# Altium schematic sheet StEth32_µC.SchDoc
size A4
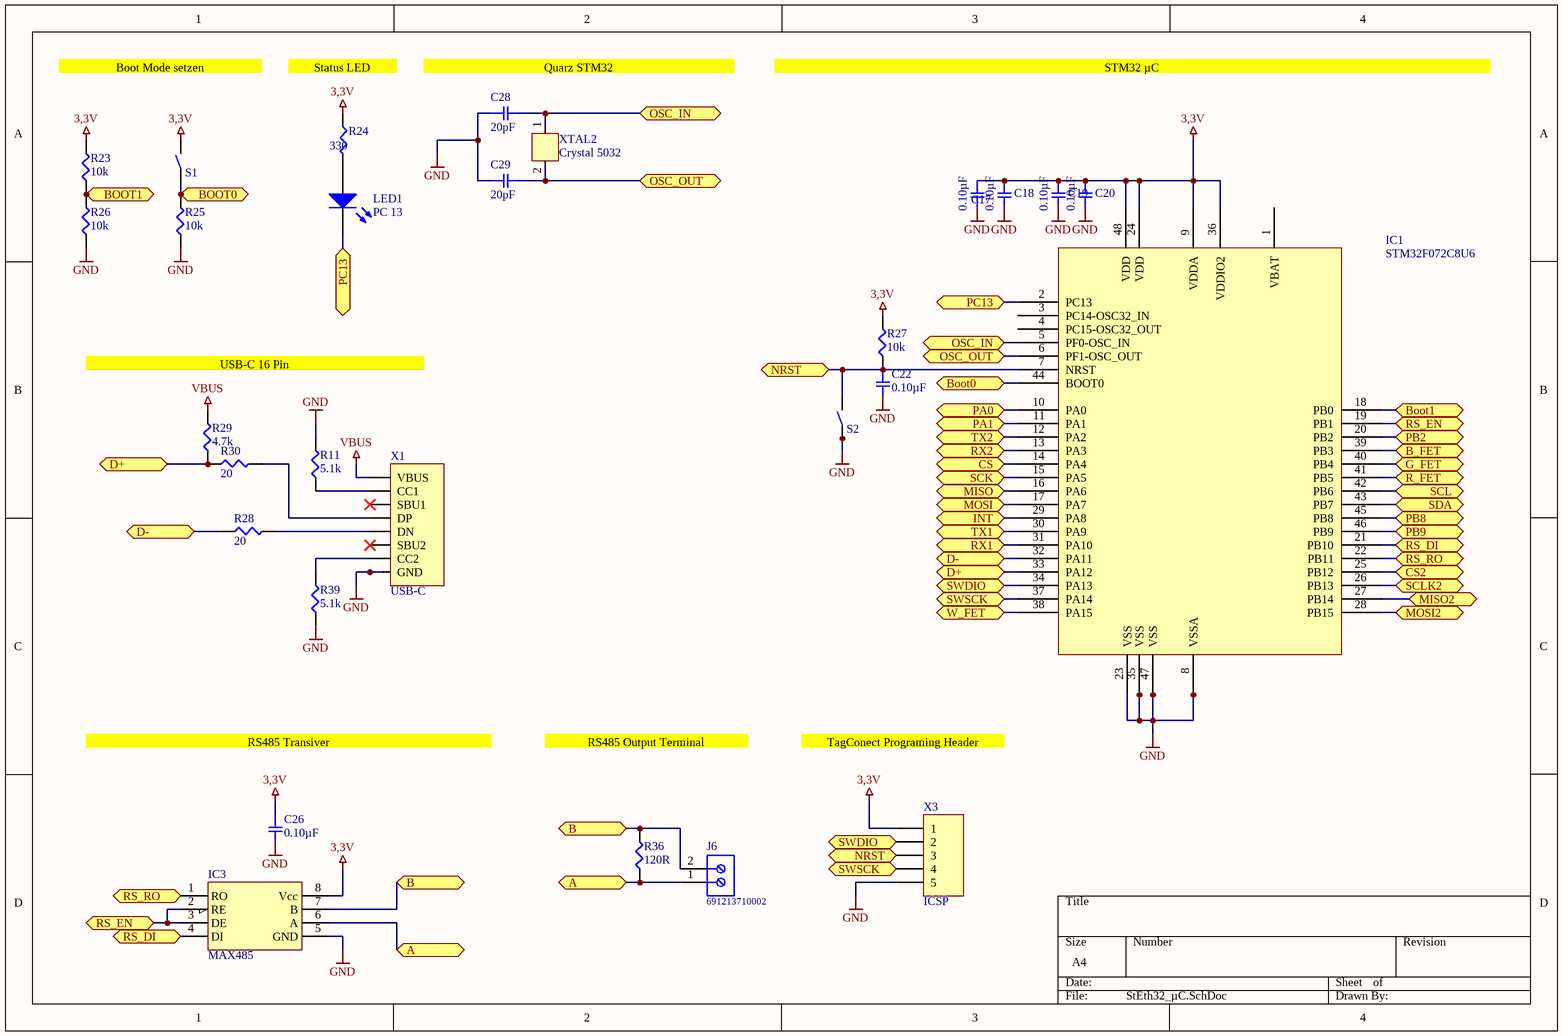
[diagram p0: StEth32_µC.SchDoc]

## Parts
C17  0.10µF  [SMD-0603C]
C18  0.10µF  [SMD-0603C]
C19  0.10µF  [SMD-0603C]
C20  0.10µF  [SMD-0603C]
C22  0.10µF  [SMD-0603C]
C26  0.10µF  [SMD-0603C]
C28  20pF  [SMD-0603C]
C29  20pF  [SMD-0603C]
IC1  STM32F072C8U6  [LQFP-48]
IC3  MAX485  [D008_L]
J6  691213710002  [691213710002]
LED1  PC 13  [0603_A]
R11  5.1k  [SMD-0603-RES]
R23  10k  [SMD-0603-RES]
R24  330  [SMD-0603-RES]
R25  10k  [SMD-0603-RES]
R26  10k  [SMD-0603-RES]
R27  10k  [SMD-0603-RES]
R28  20  [SMD-0603-RES]
R29  4.7k  [SMD-0603-RES]
R30  20  [SMD-0603-RES]
R36  120R  [SMD-0603-RES]
R39  5.1k  [SMD-0603-RES]
S1  Boot  [Button5050]  (value not drawn)
S2  Reset  [Button5050]  (value not drawn)
X1  USB-C  [USB-C]
X3  ICSP  [TC2030-MCP-NL]
XTAL2  Crystal 5032  [5032]

## Ports
A (bidir), B (bidir), B_FET (bidir), Boot0 (bidir), BOOT0 (bidir), BOOT1 (bidir), Boot1 (bidir), CS2 (bidir), CS (bidir), D+ (bidir), D- (bidir), G_FET (bidir), INT (bidir), MISO2 (bidir), MISO (bidir), MOSI2 (bidir), MOSI (bidir), NRST (bidir), OSC_IN (bidir), OSC_OUT (bidir), PA0 (bidir), PA1 (bidir), PB2 (bidir), PB8 (bidir), PB9 (bidir), PC13 (bidir), R_FET (bidir), RS_DI (bidir), RS_EN (bidir), RS_RO (bidir), RX1 (bidir), RX2 (bidir), SCK (bidir), SCL (bidir), SCLK2 (bidir), SDA (bidir), SWDIO (bidir), SWSCK (bidir), TX1 (bidir), TX2 (bidir), W_FET (bidir)

## Nets
3,3V: C17.1 C18.1 C19.1 C20.1 C26.1 IC1.9(VDDA) IC1.24(VDD) IC1.36(VDDIO2) IC1.48(VDD) IC3.8(Vcc) R23.2 R24.1 R27.2 S1.2 X3.1
GND: C17.2 C18.2 C19.2 C20.2 C22.2 C26.2 C28.1 C29.1 IC1.8(VSSA) IC1.23(VSS) IC1.35(VSS) IC1.47(VSS) IC3.5(GND) R11.2 R25.1 R26.1 R39.1 S2.1 X1.GND X3.5
VBUS: R29.2 X1.VBUS
A: IC3.6(A) J6.1 R36.1 ; port A
B: IC3.7(B) J6.2 R36.2 ; port B
B_FET: IC1.39(PB3) ; port B_FET
Boot0: IC1.44(BOOT0) R25.2 S1.1 ; port Boot0, port BOOT0
BOOT1: IC1.18(PB0) R23.1 R26.2 ; port BOOT1, port Boot1
CS: IC1.14(PA4) ; port CS
CS2: IC1.25(PB12) ; port CS2
D+: IC1.33(PA12) R29.1 R30.1 ; port D+
D-: IC1.32(PA11) R28.1 ; port D-
G_FET: IC1.40(PB4) ; port G_FET
INT: IC1.29(PA8) ; port INT
MISO: IC1.16(PA6) ; port MISO
MISO2: IC1.27(PB14) ; port MISO2
MOSI: IC1.17(PA7) ; port MOSI
MOSI2: IC1.28(PB15) ; port MOSI2
NRST: C22.1 IC1.7(NRST) R27.1 S2.2 X3.3 ; port NRST
OSC_IN: C28.2 IC1.5(PF0-OSC_IN) XTAL2.1 ; port OSC_IN
OSC_OUT: C29.2 IC1.6(PF1-OSC_OUT) XTAL2.2 ; port OSC_OUT
PA0: IC1.10(PA0) ; port PA0
PA1: IC1.11(PA1) ; port PA1
PB2: IC1.20(PB2) ; port PB2
PB8: IC1.45(PB8) ; port PB8
PB9: IC1.46(PB9) ; port PB9
PC13: IC1.2(PC13) LED1.1(K) ; port PC13
R_FET: IC1.41(PB5) ; port R_FET
RS_DI: IC1.21(PB10) IC3.4(DI) ; port RS_DI
RS_EN: IC1.19(PB1) IC3.2(RE) IC3.3(DE) ; port RS_EN
RS_RO: IC1.22(PB11) IC3.1(RO) ; port RS_RO
RX1: IC1.31(PA10) ; port RX1
RX2: IC1.13(PA3) ; port RX2
SCK: IC1.15(PA5) ; port SCK
SCL: IC1.42(PB6) ; port SCL
SCLK2: IC1.26(PB13) ; port SCLK2
SDA: IC1.43(PB7) ; port SDA
SWDIO: IC1.34(PA13) X3.2 ; port SWDIO
SWSCK: IC1.37(PA14) X3.4 ; port SWSCK
TX1: IC1.30(PA9) ; port TX1
TX2: IC1.12(PA2) ; port TX2
W_FET: IC1.38(PA15) ; port W_FET
NetLED1_2: LED1.2(A) R24.2
NetR11_1: R11.1 X1.CC1
NetR28_2: R28.2 X1.DN
NetR30_2: R30.2 X1.DP
NetR39_2: R39.2 X1.CC2

Not connected (* = marked no-connect by the designer): IC1 1(VBAT) 3(PC14-OSC32_IN) 4(PC15-OSC32_OUT); X1 SBU1*

## Notes on the sheet
- Boot Mode setzen
- Status LED
- Quarz STM32
- STM32 µC
  STM32 µC
- USB-C 16 Pin
- RS485 Transiver
- RS485 Output Terminal
- TagConect Programing Header

## Library data of the parts
C17-C20 C22 C26 C28 C29 = GCM188R71C104KA37J: CAP CER 0.1UF 16V X7R 0603; Manufacturer: Murata Electronics North America; Factory Stock: 0; Unit Price (USD): 0.18; Minimum Quantity: 1; Tolerance: ±10%; Datasheets: http://www.murata.com/~/media/webrenewal/support/library/catalog/products/capacitor/mlcc/c03e.ashx; Image: //media.digikey.com/Renders/Murata%20Renders/0603%28GCM188%29.jpg; Digi-Key Part Number: 490-8015-1-ND; Part Number: GCM188R71C104KA37J; Quantity Available: 17844; @ qty: 0; Packaging: Cut Tape (CT); Series: GCM; Part Status: Active; Voltage: 16V; Temperature Coefficient: X7R; Operating Temperature: -55°C ~ 125°C; Features: -; Ratings: AEC-Q200; Applications: Automotive; Mounting Type: Surface Mount, MLCC; Package / Case: 0603 (1608 Metric); Size / Dimension: 0.063" L x 0.031" W (1.60mm x 0.80mm); Height - Seated (Max): -; Thickness (Max): 0.035" (0.90mm); Lead Spacing: -; Lead Style: -
  C17-C20 C22 C26: Value: 0.10µF
  C28 C29: Value: 20pF
J6 = 691213710002: Serie 213 - 5.00 mm Horizontal Entry Modular with RisingCage Clamp WR-TBL, 2 pin; Pin Number: 2; Pitch: 5.00 mm; ComponentLink1Description: Manufacturer; ComponentLink1URL: http://www.we-online.de; ComponentLink2Description: Datasheet; ComponentLink2URL: http://katalog.we-online.de/em/datasheet/6912137100xx.pdf; Part Number: 691213710002; Published Date: June 2018; Publisher: Wurth Elektronik; Operating Temperature: -40 to 105 degC; Mounting Technology: THT; Packaging: Box
LED1 = 150060SS75000: SMD mono-color Chip LED, WL-SMCW, Super Red; PackageReference: 0603_A; Color: Super Red; PartNumber: 150060SS75000; ComponentLink1Description: Manufacturer URL; ComponentLink1URL: http://www.we-online.com; ComponentLink2Description: Datasheet; ComponentLink2URL: http://katalog.we-online.com/led/datasheet/150060SS75000.pdf
R11 R39 = ERJ-3GEYJ512V: RES SMD 5.1K OHM 5% 1/10W 0603; Manufacturer: Panasonic Electronic Components; Factory Stock: 0; Unit Price (USD): 0.00321; @ qty: 1500; Minimum Quantity: 1; Power (Watts): 0.1W, 1/10W; Temperature Coefficient: ±200ppm/°C; Part Number: ERJ-3GEYJ512V; Datasheets: http://industrial.panasonic.com/www-cgi/jvcr13pz.cgi?E+PZ+3+AOA0001+ERJ3GEYJ512V+7+WW; Image: //media.digikey.com/Photos/Panasonic%20Photos/MFG_ERJ-P6W%20Series.jpg; Digi-Key Part Number: P5.1KGCT-ND; Quantity Available: 285626; Packaging: Cut Tape (CT); Series: ERJ; Part Status: Active; Value: 5.1k; Tolerance: ±5%; Composition: Thick Film; Features: Automotive AEC-Q200; Operating Temperature: -55°C ~ 155°C; Package / Case: 0603 (1608 Metric); Supplier Device Package: 0603; Size / Dimension: 0.063" L x 0.031" W (1.60mm x 0.80mm); Height - Seated (Max): 0.022" (0.55mm); Number of Terminations: 2; Failure Rate: -
R23 R25-R27 = ERJ-3EKF1002V: RES SMD 10K OHM 1% 1/10W 0603; Manufacturer: Panasonic Electronic Components; Factory Stock: 0; Unit Price (USD): 0.00379; @ qty: 1500; Minimum Quantity: 1; Power (Watts): 0.1W, 1/10W; Temperature Coefficient: ±100ppm/°C; Part Number: ERJ-3EKF1002V; Datasheets: http://industrial.panasonic.com/www-cgi/jvcr13pz.cgi?E+PZ+3+AOA0002+ERJ3EKF1002V+7+WW; Image: //media.digikey.com/Photos/Panasonic%20Photos/MFG_ERJ-P6W%20Series.jpg; Digi-Key Part Number: P10.0KHCT-ND; Quantity Available: 6703141; Packaging: Cut Tape (CT); Series: ERJ; Part Status: Active; Value: 10k; Tolerance: ±1%; Composition: Thick Film; Features: Automotive AEC-Q200; Operating Temperature: -55°C ~ 155°C; Package / Case: 0603 (1608 Metric); Supplier Device Package: 0603; Size / Dimension: 0.063" L x 0.031" W (1.60mm x 0.80mm); Height - Seated (Max): 0.022" (0.55mm); Number of Terminations: 2; Failure Rate: -
R24 = ERJ-3EKF3300V: RES SMD 330 OHM 1% 1/10W 0603; Manufacturer: Panasonic Electronic Components; Factory Stock: 0; Unit Price (USD): 0.00379; @ qty: 1500; Minimum Quantity: 1; Power (Watts): 0.1W, 1/10W; Temperature Coefficient: ±100ppm/°C; Part Number: ERJ-3EKF3300V; Datasheets: http://industrial.panasonic.com/www-cgi/jvcr13pz.cgi?E+PZ+3+AOA0002+ERJ3EKF3300V+7+WW; Image: //media.digikey.com/Photos/Panasonic%20Photos/MFG_ERJ-P6W%20Series.jpg; Digi-Key Part Number: P330HCT-ND; Quantity Available: 670984; Packaging: Cut Tape (CT); Series: ERJ; Part Status: Active; Value: 330; Tolerance: ±1%; Composition: Thick Film; Features: Automotive AEC-Q200; Operating Temperature: -55°C ~ 155°C; Package / Case: 0603 (1608 Metric); Supplier Device Package: 0603; Size / Dimension: 0.063" L x 0.031" W (1.60mm x 0.80mm); Height - Seated (Max): 0.022" (0.55mm); Number of Terminations: 2; Failure Rate: -
R28 R30 = ERJ-3EKF20R0V: RES SMD 20 OHM 1% 1/10W 0603; Manufacturer: Panasonic Electronic Components; Factory Stock: 0; Unit Price (USD): 0.00379; @ qty: 1500; Minimum Quantity: 1; Power (Watts): 0.1W, 1/10W; Temperature Coefficient: ±100ppm/°C; Part Number: ERJ-3EKF20R0V; Datasheets: http://industrial.panasonic.com/www-cgi/jvcr13pz.cgi?E+PZ+3+AOA0002+ERJ3EKF20R0V+7+WW; Image: //media.digikey.com/Photos/Panasonic%20Photos/MFG_ERJ-P6W%20Series.jpg; Digi-Key Part Number: P20.0HCT-ND; Quantity Available: 92419; Packaging: Cut Tape (CT); Series: ERJ; Part Status: Active; Value: 20; Tolerance: ±1%; Composition: Thick Film; Features: Automotive AEC-Q200; Operating Temperature: -55°C ~ 155°C; Package / Case: 0603 (1608 Metric); Supplier Device Package: 0603; Size / Dimension: 0.063" L x 0.031" W (1.60mm x 0.80mm); Height - Seated (Max): 0.022" (0.55mm); Number of Terminations: 2; Failure Rate: -
R29 R36 = ERJ-3EKF4701V: RES SMD 4.7K OHM 1% 1/10W 0603; Manufacturer: Panasonic Electronic Components; Factory Stock: 0; Unit Price (USD): 0.00379; @ qty: 1500; Minimum Quantity: 1; Power (Watts): 0.1W, 1/10W; Temperature Coefficient: ±100ppm/°C; Part Number: ERJ-3EKF4701V; Datasheets: http://industrial.panasonic.com/www-cgi/jvcr13pz.cgi?E+PZ+3+AOA0002+ERJ3EKF4701V+7+WW; Image: //media.digikey.com/Photos/Panasonic%20Photos/MFG_ERJ-P6W%20Series.jpg; Digi-Key Part Number: P4.70KHCT-ND; Quantity Available: 999380; Packaging: Cut Tape (CT); Series: ERJ; Part Status: Active; Tolerance: ±1%; Composition: Thick Film; Features: Automotive AEC-Q200; Operating Temperature: -55°C ~ 155°C; Package / Case: 0603 (1608 Metric); Supplier Device Package: 0603; Size / Dimension: 0.063" L x 0.031" W (1.60mm x 0.80mm); Height - Seated (Max): 0.022" (0.55mm); Number of Terminations: 2; Failure Rate: -
  R29: Value: 4.7k
  R36: Value: 120R
S1 S2 = Button: 6.1x3.7x2.5mm
X1 = USB-C 16P
XTAL2 = 5032